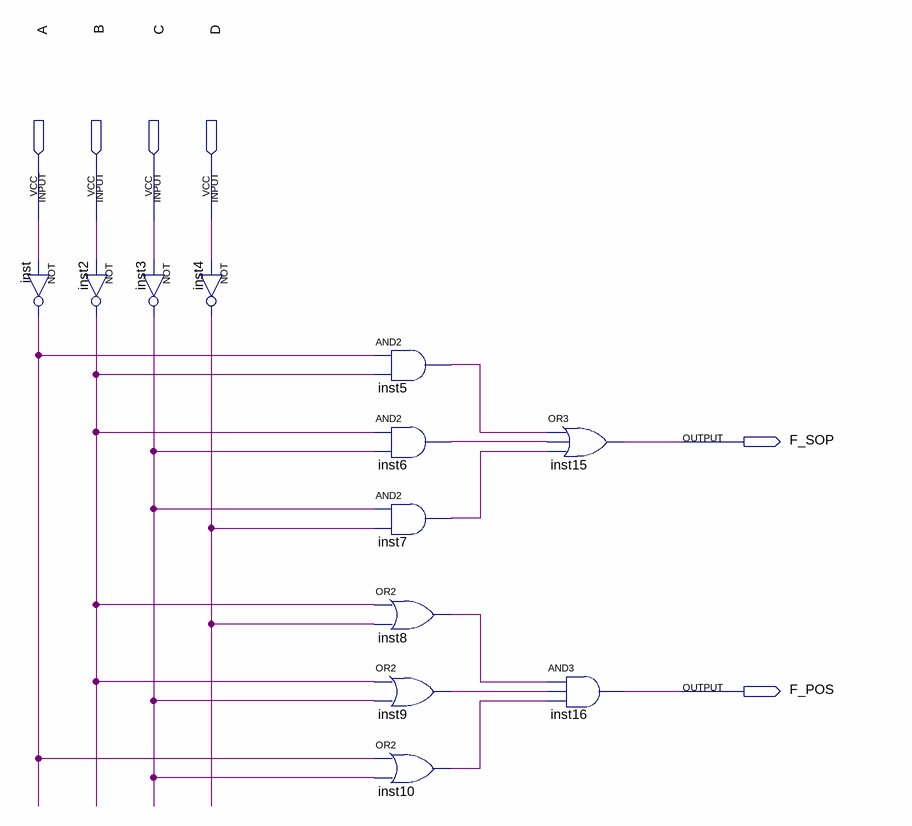
[diagram p0: schematic sheet]
// Quartus schematic step02.bdf as structural Verilog: 12 symbols, 6 pins
module step02 (
  input  A,
  input  B,
  input  C,
  input  D,
  output F_SOP,
  output F_POS
);

  wire inst2_out, inst3_out, inst4_out, inst5_out, inst6_out, inst7_out, inst8_out, inst9_out, inst10_out,
       inst_out;

  not inst (inst_out, A);
  not inst2 (inst2_out, B);
  not inst3 (inst3_out, C);
  not inst4 (inst4_out, D);
  and inst5 (inst5_out, inst_out, inst2_out);
  and inst6 (inst6_out, inst2_out, inst3_out);
  and inst7 (inst7_out, inst3_out, inst4_out);
  or inst8 (inst8_out, inst2_out, inst4_out);
  or inst9 (inst9_out, inst2_out, inst3_out);
  or inst10 (inst10_out, inst_out, inst3_out);
  or inst15 (F_SOP, inst5_out, inst6_out, inst7_out);
  and inst16 (F_POS, inst8_out, inst9_out, inst10_out);
endmodule
